# Altium schematic sheet JMU 2018 Camera主板 2.0 核心板.16_1第二板.SchDoc
size A3
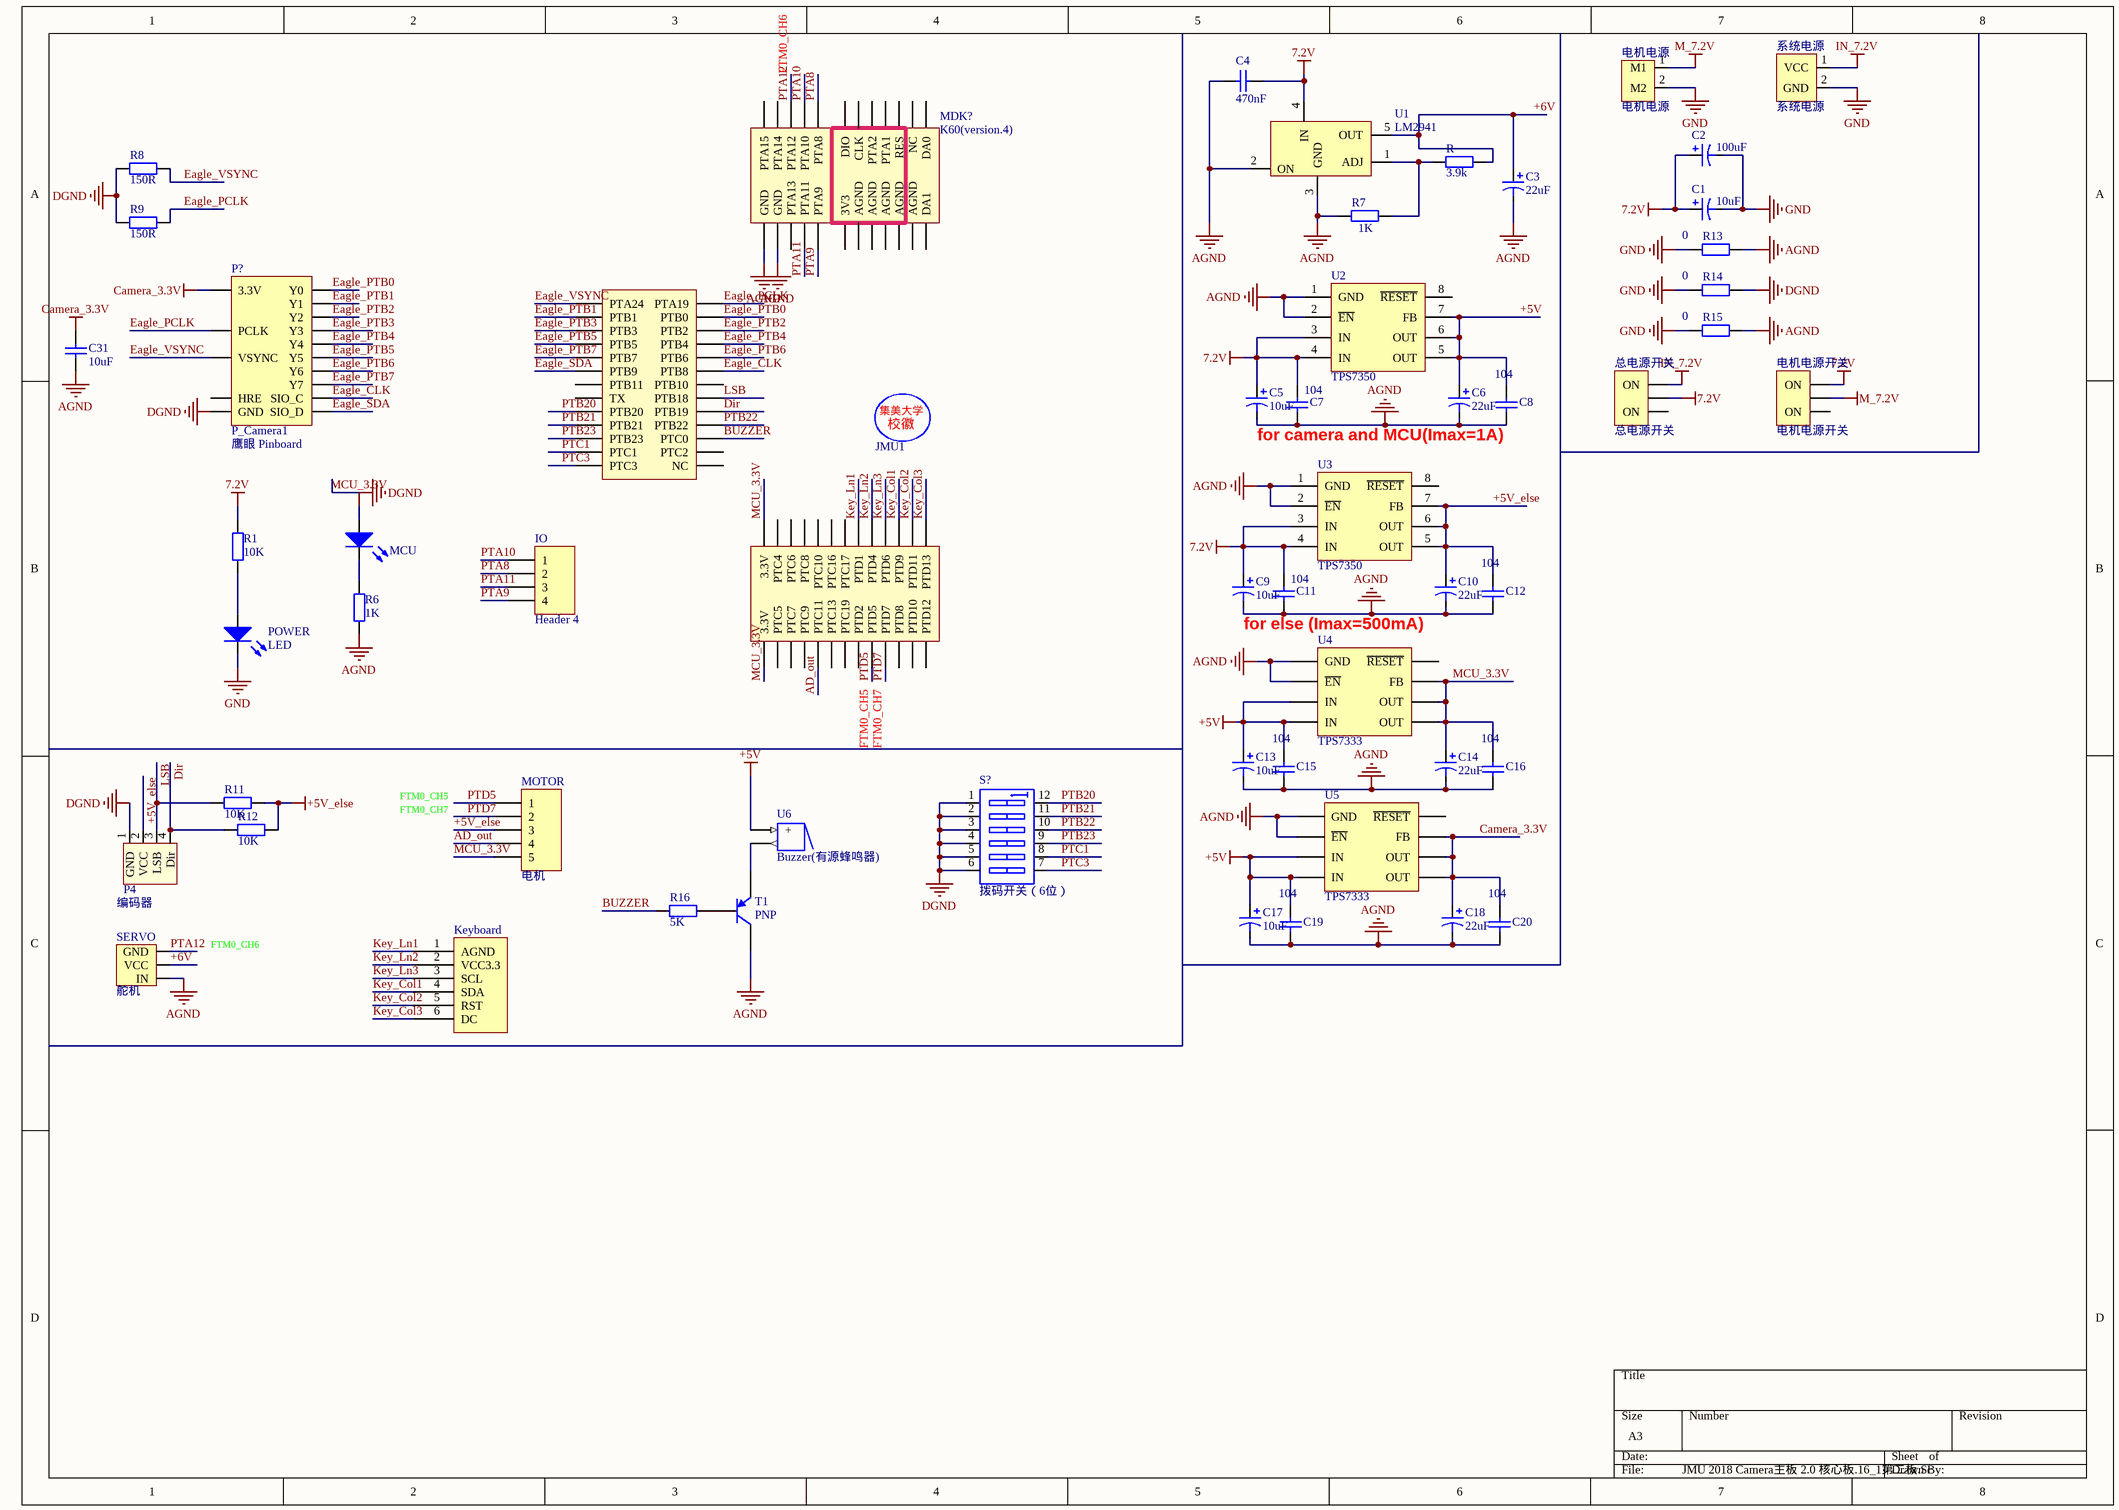
[diagram p0: JMU 2018 Camera主板 2.0 核心板.16_1第二板.SchDoc]

## Parts
C1  10uF  [pol cap(10uF)]
C2  100uF  [pol cap(10uF)]
C3  value 22uF  [pol cap(10uF)]  (hidden comment: pol cap)
C4  470nF  [0805]
C5  10uF  [pol cap(10uF)]
C6  22uF  [pol cap(10uF)]
C7  104  [0805]
C8  104  [0805]
C9  10uF  [pol cap(10uF)]
C10  22uF  [pol cap(10uF)]
C11  104  [0805]
C12  104  [0805]
C13  10uF  [pol cap(10uF)]
C14  22uF  [pol cap(10uF)]
C15  104  [0805]
C16  104  [0805]
C17  10uF  [pol cap(10uF)]
C18  22uF  [pol cap(10uF)]
C19  104  [0805]
C20  104  [0805]
C31  10uF  [0805]
IO  Header 4  [HDR1X4]
JMU1  LOGO(JMU)  [JMU_logo]  (value not drawn)
Keyboard  OLED  [HDR1X6]  (value not drawn)
LED1  MCU  [LED(0805)]
MDK?  K60(version.4)  [K60(V.4)]
MOTOR  电机  [HDR1X5]
P4  编码器  [编码器]
P?  P_Camera1  [鹰眼Pin_Board]
POWER  LED  [LED(0805)]
R  3.9k  [0805]
R1  10K  [0805]
R6  1K  [0805]
R7  1K  [0805]
R8  150R  [0603]
R9  150R  [0603]
R11  10K  [0805]
R12  10K  [0805]
R13  0  [0805]
R14  0  [0805]
R15  0  [0805]
R16  5K  [0805]
S?  拨码开关（6位）  [拨码开关*6]
SERVO  舵机  [HDR_1X3]
T1  PNP  [PNP]
U1  LM2941  [LM2941]
U2  TPS7350  [SOIC-8]
U3  TPS7350  [SOIC-8]
U4  TPS7333  [SOIC-8]
U5  TPS7333  [SOIC-8]
U6  Buzzer(有源蜂鸣器)  [Buzzer]
总电源开关  总电源开关  [钮子开关（大）]
电机电源  电机电源  [接线端子]
电机电源开关  电机电源开关  [钮子开关（大）]
系统电源  系统电源  [T型接头]

## Nets
7.2V: C1.1 C2.1 C4.2 C5.1 C7.2 C9.1 C11.2 R1.2 U1.4(IN) U2.3(IN) U2.4(IN) U3.3(IN) U3.4(IN) 总电源开关.2(com) 电机电源开关.3(ON)
+5V: C6.1 C8.2 C13.1 C15.2 C17.1 C19.2 U2.5(OUT) U2.6(OUT) U2.7(FB) U4.3(IN) U4.4(IN) U5.3(IN) U5.4(IN) U6.1(+)
+5V_else: C10.1 C12.2 MOTOR.3 P4.2(VCC) R11.2 R12.2 U3.5(OUT) U3.6(OUT) U3.7(FB)
AGND: C3.2 C4.1 C5.2 C6.2 C7.1 C8.1 C9.2 C10.2 C11.1 C12.1 C13.2 C14.2 C15.1 C16.1 C17.2 C18.2 C19.1 C20.1 C31.1 MDK?.20(GND) MDK?.22(GND) R6.1 R7.2 R13.2 R15.2 SERVO.1(IN) T1.1(C) U1.2(ON) U1.3(GND) U2.1(GND) U2.2(~{EN}) U3.1(GND) U3.2(~{EN}) U4.1(GND) U4.2(~{EN}) U5.1(GND) U5.2(~{EN})
Camera_3.3V: C18.1 C20.2 C31.2 P?.1(3.3V) U5.5(OUT) U5.6(OUT) U5.7(FB)
DGND: P4.1(GND) P?.10(GND) R8.1 R9.1 R14.2 S?.1(A1) S?.2(A2) S?.3(A3) S?.4(A4) S?.5(A5) S?.6(A5)
GND: C1.2 C2.2 POWER.2(K) R13.1 R14.1 R15.1 电机电源.2(M2) 系统电源.2(GND)
IN_7.2V: 总电源开关.3(ON) 系统电源.1(VCC)
M_7.2V: 电机电源.1(M1) 电机电源开关.2(com)
MCU_3.3V: C14.1 C16.2 LED1.1(A) MDK?.49(3.3V) MDK?.50(3.3V) MOTOR.5 U4.5(OUT) U4.6(OUT) U4.7(FB)
+6V: C3.1 R.2 SERVO.2(VCC) U1.5(OUT)
AD_out: MDK?.58(PTC11) MOTOR.4
BUZZER: MDK?.43(PTC0) R16.1
Dir: MDK?.39(PTB19) P4.4(Dir) R12.1
Eagle_CLK: MDK?.33(PTB8) P?.12(SIO_C)
Eagle_PCLK: MDK?.23(PTA19) P?.4(PCLK) R9.2
Eagle_PTB0: MDK?.25(PTB0) P?.20(Y0)
Eagle_PTB1: MDK?.26(PTB1) P?.19(Y1)
Eagle_PTB2: MDK?.27(PTB2) P?.18(Y2)
Eagle_PTB3: MDK?.28(PTB3) P?.17(Y3)
Eagle_PTB4: MDK?.29(PTB4) P?.16(Y4)
Eagle_PTB5: MDK?.30(PTB5) P?.15(Y5)
Eagle_PTB6: MDK?.31(PTB6) P?.14(Y6)
Eagle_PTB7: MDK?.32(PTB7) P?.13(Y7)
Eagle_SDA: MDK?.34(PTB9) P?.11(SIO_D)
Eagle_VSYNC: MDK?.24(PTA24) P?.6(VSYNC) R8.2
Key_Col1: Keyboard.4(SDA) MDK?.69(PTD9)
Key_Col2: Keyboard.5(RST) MDK?.71(PTD11)
Key_Col3: Keyboard.6(DC) MDK?.73(PTD13)
Key_Ln1: Keyboard.1(AGND) MDK?.63(PTD1)
Key_Ln2: Keyboard.2(VCC3.3) MDK?.65(PTD4)
Key_Ln3: Keyboard.3(SCL) MDK?.67(PTD6)
LSB: MDK?.37(PTB18) P4.3(LSB) R11.1
PTA8: IO.2 MDK?.13(PTA8)
PTA9: IO.4 MDK?.14(PTA9)
PTA10: IO.1 MDK?.15(PTA10)
PTA11: IO.3 MDK?.16(PTA11)
PTA12: MDK?.17(PTA12) SERVO.3(GND)
PTB20: MDK?.40(PTB20) S?.12(B1)
PTB21: MDK?.42(PTB21) S?.11(B2)
PTB22: MDK?.41(PTB22) S?.10(B3)
PTB23: MDK?.44(PTB23) S?.9(B4)
PTC1: MDK?.46(PTC1) S?.8(B5)
PTC3: MDK?.48(PTC3) S?.7(B5)
PTD5: MDK?.66(PTD5) MOTOR.1
PTD7: MDK?.68(PTD7) MOTOR.2
NetLED1_2: LED1.2(K) R6.2
NetPOWER_1: POWER.1(A) R1.1
NetR16_2: R16.2 T1.2(B)
NetR_1: R.1 R7.1 U1.1(ADJ)
NetT1_3: T1.3(E) U6.2

Not connected (* = marked no-connect by the designer): MDK? 1(DA0) 2(DA1) 3(NC) 4(AGND) 5(RES) 6(AGND) 7(PTA1) 8(AGND) 9(PTA2) 10(AGND) 11(DIO) 12(3V3) 18(PTA13) 19(PTA14) 21(PTA15) 35(PTB10) 36(PTB11) 38(TX) 45(PTC2) 47(NC) 51(PTC4) 52(PTC5) 53(PTC6) 54(PTC7) 55(PTC8) 56(PTC9) 57(PTC10) 59(PTC16) 60(PTC13) 61(PTC17) 62(PTC19) 64(PTD2) 70(PTD8) 72(PTD10) 74(PTD12) 75(CLK) 76(AGND); P? 9(HRE); U2 8(~{RESET}); U3 8(~{RESET}); U4 8(~{RESET}); U5 8(~{RESET}); 总电源开关 1(ON); 电机电源开关 1(ON)

## Notes on the sheet
- FTM0_CH6
- for camera and MCU(Imax=1A)
- for else (Imax=500mA)
- FTM0_CH5
- FTM0_CH7
- (in symbol JMU-LOGO) 集美大学; 校徽

## Library data of the parts
C1 C2 C5 C9 C13 C17 = pol cap: 通用有极电容; value: 22uF
C3 C6 C10 C14 C18 = pol cap: 通用有极电容
  C6 C10 C14 C18: value: 22uF
C4 C7 C8 C11 C12 C15 C16 C19 C20 C31 = Cap: 无极电容
  C4: Value: 470NF
  C7 C8 C11 C12 C15 C16 C19 C20: Value: 104
  C31: Value: 10uF
IO = Header 4: Header, 4-Pin; LatestRevisionDate: 17-Jul-2002; LatestRevisionNote: Re-released for DXP Platform.; Publisher: Altium Limited
JMU1 = JMU-LOGO
LED1 POWER = LED: 发光二极管
MDK? = K60(V.4): default part:UART0 SWD/JTAG  LQ_OLED
MOTOR = Header 5: Header, 5-Pin; LatestRevisionDate: 17-Jul-2002; LatestRevisionNote: Re-released for DXP Platform.; Publisher: Altium Limited
P? = P_Camera1: 鹰眼 Pinboard; Co: 鹰眼 Pinboard
R R6 R8 R9 R13-R16 = Res: 通用电阻; Value: 10K
R1 R7 R11 R12 = Res: 通用电阻
  R1 R11 R12: Value: 10K
  R7: Value: 1K
SERVO = 舵机: 舵机...
U1 = LM2941: 稳压元件-->6V
U2 U3 = TPS7350: 稳压元件（5V）
U4 U5 = TPS7333: 稳压元件（3.3V）
总电源开关 电机电源开关 = 钮子开关（大）: AC 250V/6A
电机电源 = 接线端子
系统电源 = 电源接线端子: 电源线